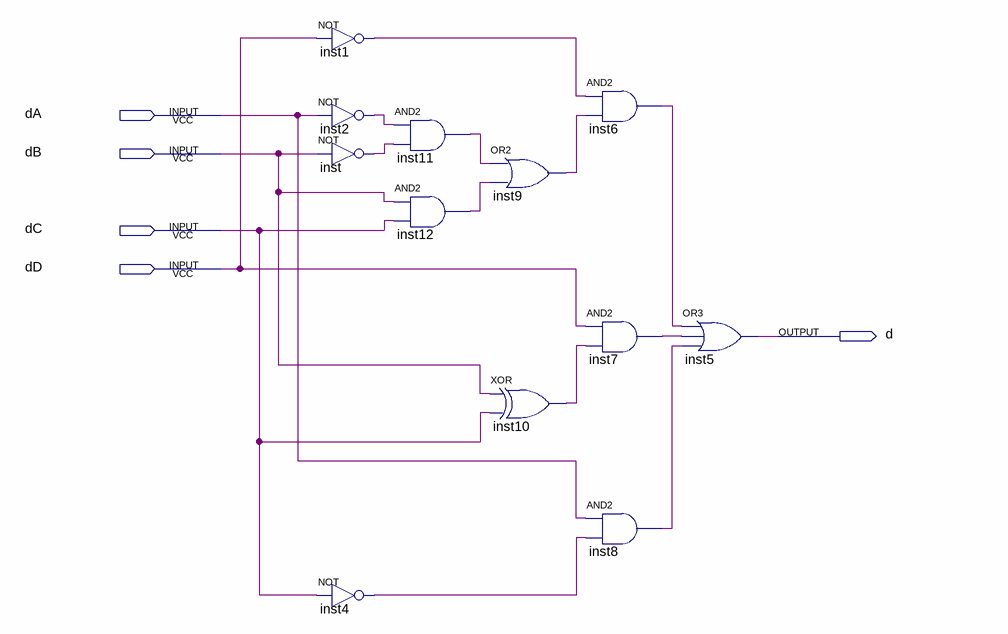
[diagram p0: schematic sheet]
// Quartus schematic segmentoD.bdf as structural Verilog: 12 symbols, 5 pins
module segmentoD (
  input  dA,
  input  dB,
  input  dC,
  input  dD,
  output d
);

  wire inst1_out, inst2_out, inst4_out, inst6_out, inst7_out, inst8_out, inst9_out, inst10_out, inst11_out,
       inst12_out, inst_out;

  not inst1 (inst1_out, dD);
  not inst2 (inst2_out, dA);
  not inst (inst_out, dB);
  not inst4 (inst4_out, dC);
  and inst11 (inst11_out, inst2_out, inst_out);
  and inst12 (inst12_out, dB, dC);
  or inst9 (inst9_out, inst11_out, inst12_out);
  xor inst10 (inst10_out, dB, dC);
  and inst6 (inst6_out, inst1_out, inst9_out);
  and inst7 (inst7_out, dD, inst10_out);
  and inst8 (inst8_out, dA, inst4_out);
  or inst5 (d, inst6_out, inst7_out, inst8_out);
endmodule
